# Altium project slave2020.PrjPcb
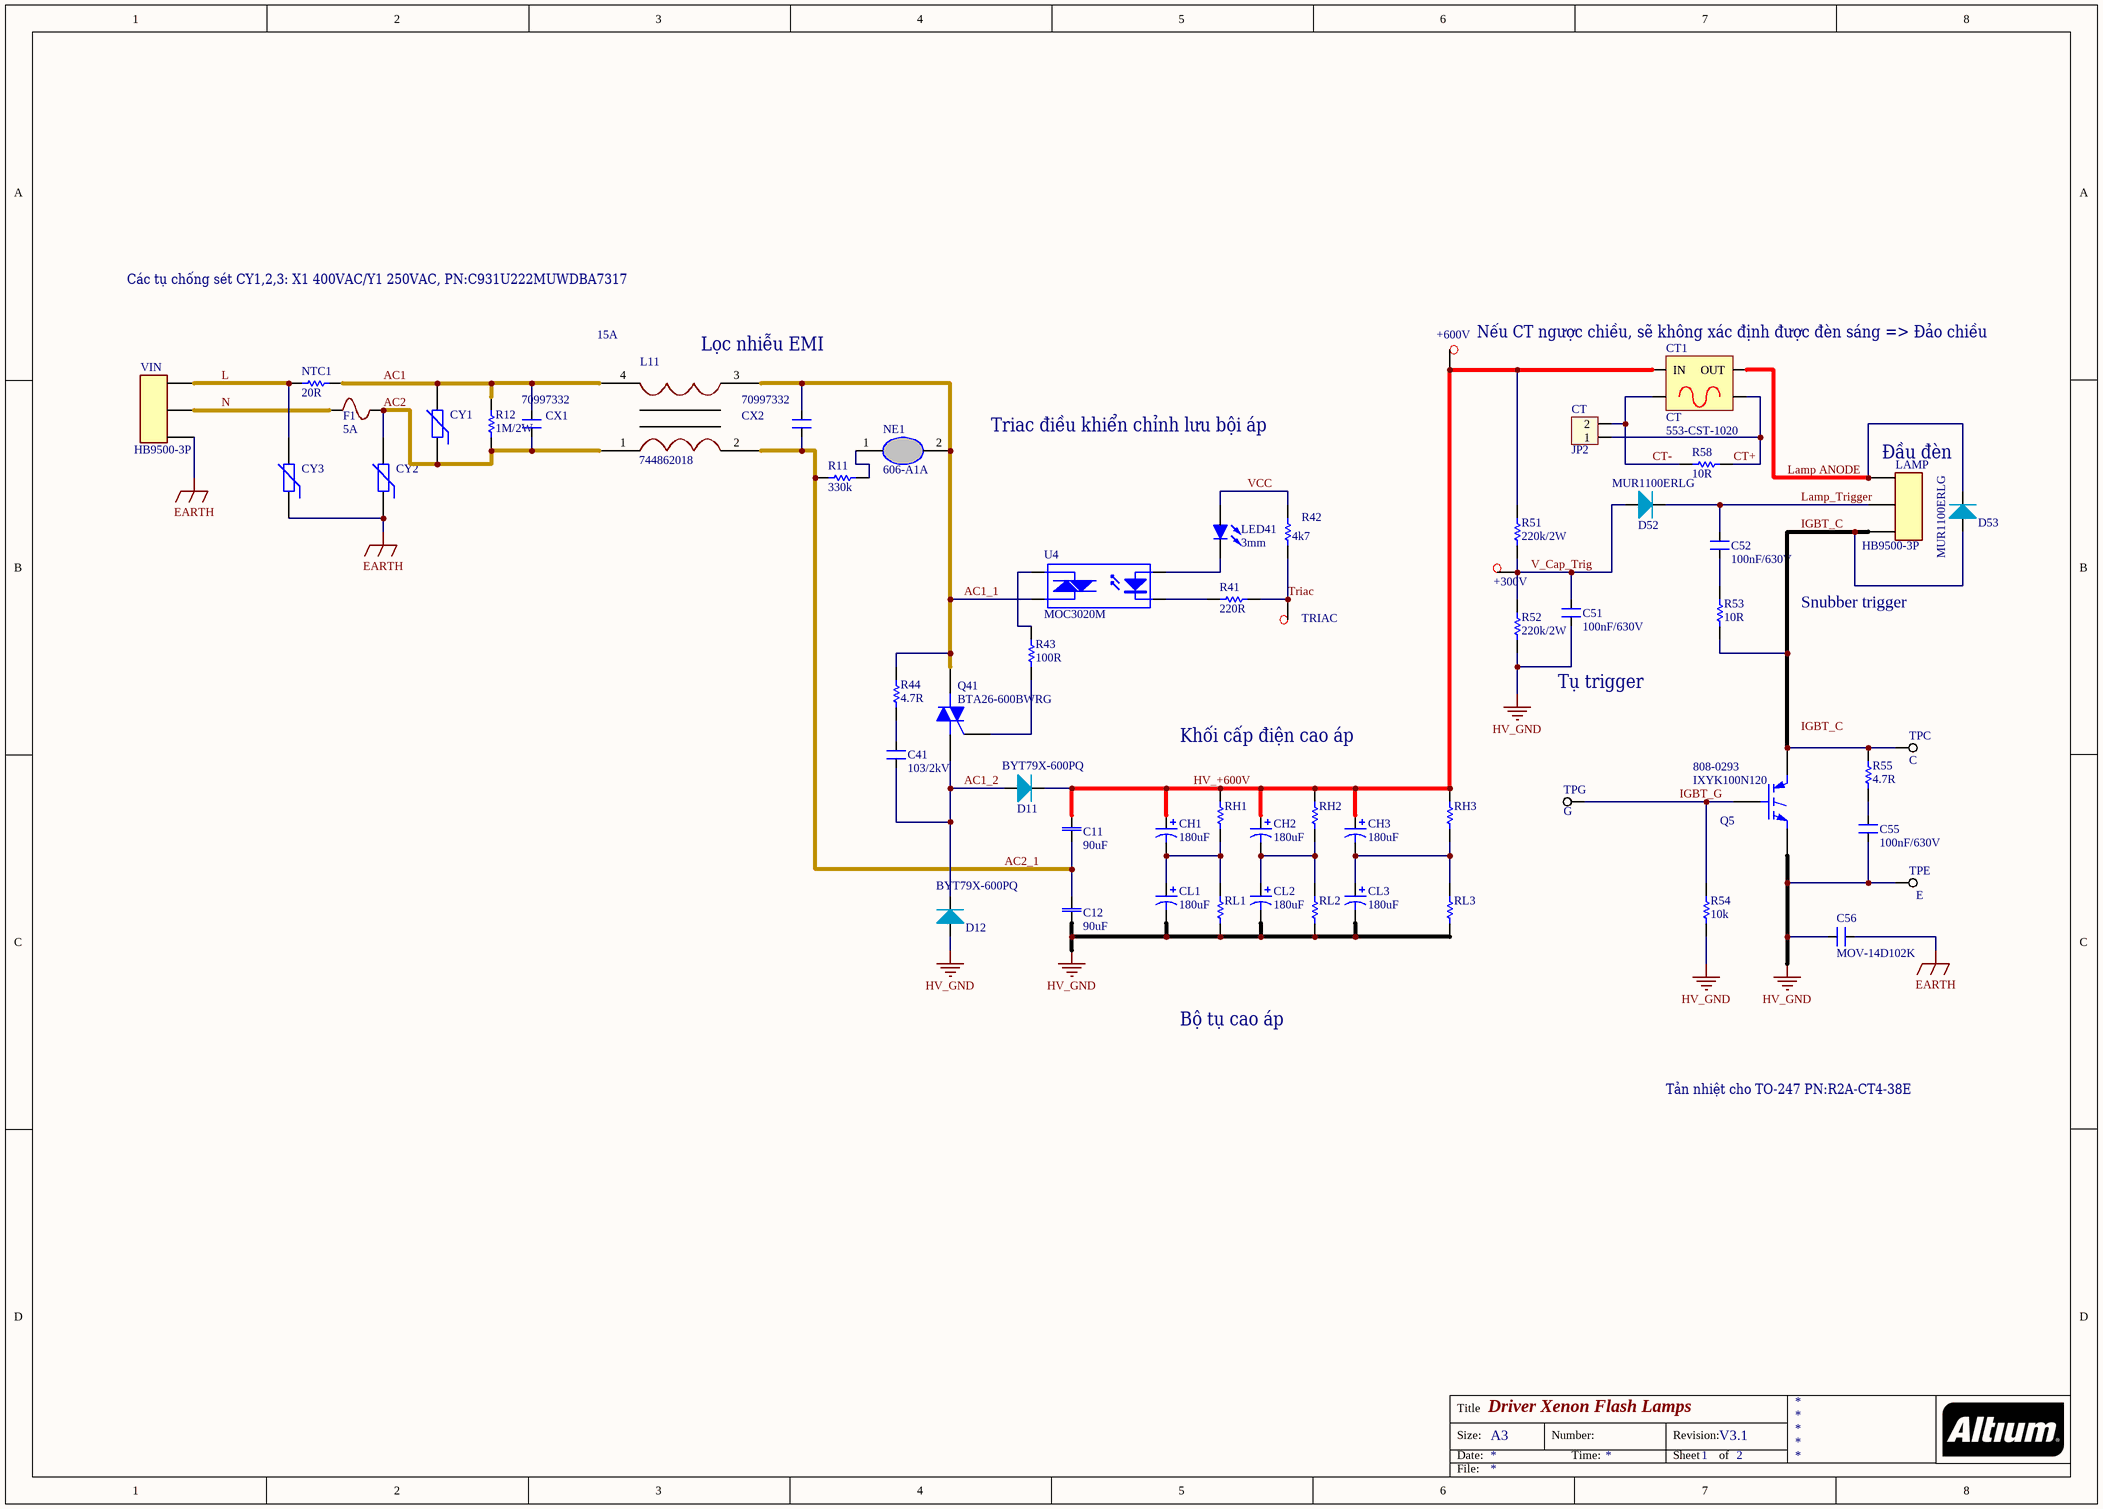
[diagram p0: IGBT2020.SchDoc]
2 sheets, 119 parts. Net scope: global (net labels, ports and power ports of the same name join across sheets).
Board file: slave2020.PcbDoc
Sheets:
  IGBT2020.SchDoc
  DriveIGBT2020.SchDoc

## Sheet IGBT2020.SchDoc: Driver Xenon Flash Lamps
size A3; Date: 5/12/2017; CheckedBy: Vũ Hoàng Phương; CompanyName: PE-LAB; DrawnBy: Bùi Trung Tuyến; Revision: V3.1; SheetNumber: 1; SheetTotal: 2; PageSetup: Record=PageOptions|CenterHorizontal=True|CenterVertical=True|PrintScale=0.71|XCorrection=1.00|YCorrection=1.00|PrintKind=1|BorderSize=5000000|LeftOffset=0|BottomOffset=0|Orientation=2|PaperLength=1000|PaperWidth=1000|Scale=100|PaperSource=257|PrintQuality=600|MediaType=1|DitherType=10|PrintScaleMode=1|PaperKind=A3|PaperIndex=8; Version: 3.1; ProjectName: ATTECH

### Parts
+300V  TP  [TP2]  (value not drawn)
+600V  TP  [TP2]  (value not drawn)
C11  Capacitance: 90uF  [Kemet 90uF 500V]  (hidden comment: C4AQ, Film, Metallized Polypropylene, Automotive DC Link, 90 uF, 10%, 500 V, 70C, Lead Spacing = 37.5mm)
C12  Capacitance: 90uF  [Kemet 90uF 500V]  (hidden comment: C4AQ, Film, Metallized Polypropylene, Automotive DC Link, 90 uF, 10%, 500 V, 70C, Lead Spacing = 37.5mm)
C41  103/2kV  [CN2-LT]
C51  100nF/630V  [X2 CAP]
C52  100nF/630V  [X2 CAP]
C55  100nF/630V  [X2 CAP]
C56  MOV-14D102K  [MOV]
CH1  180uF  [CAP 25x50]
CH2  180uF  [CAP 25x50]
CH3  180uF  [CAP 25x50]
CL1  180uF  [CAP 25x50]
CL2  180uF  [CAP 25x50]
CL3  180uF  [CAP 25x50]
CT  JP2  [CON2]
CT1  CT  Supplier Part Number 1: 553-CST-1020  [PCBComponent_1]
CX1  spn1: 70997332  [X2 CAP]  (hidden comment: Tụ lọc nhiễu X2 chân cắm220nF70997332)
CX2  spn1: 70997332  [X2 CAP]  (hidden comment: Tụ lọc nhiễu X2 chân cắm220nF70997332)
CY1  Varistor chân cắmC931U222MUWDBA7317  [MOV]  (value not drawn)
CY2  Varistor chân cắmC931U222MUWDBA7317  [MOV]  (value not drawn)
CY3  Varistor chân cắmC931U222MUWDBA7317  [MOV]  (value not drawn)
D11  Supplier Part Number 1: BYT79X-600PQ  [TO-220F]  (hidden comment: Đi ốt cắmBYT79X-600PQ)
D12  Supplier Part Number 1: BYT79X-600PQ  [TO-220F]  (hidden comment: Đi ốt cắmBYT79X-600PQ)
D52  vl1: MUR1100ERLG  [DO-41]  (hidden comment: Đi ốt cắmMUR1100ERLG)
D53  vl1: MUR1100ERLG  [DO-41]  (hidden comment: Đi ốt cắmMUR1100ERLG)
F1  value 5A  [Fuse]  (hidden comment: Cầu chì ống thủy tinh5A)
L11  744862018  Max Current Rating: 15A  [Choke 5A]
LAMP  value HB9500-3P  [HB9500-3P]  (hidden comment: Giắc nguồn 3 chân. 9.5mm :HB9500-3P)
LED41  3mm  [LED 3mm]
NE1  606-A1A  [NE2]
NTC1  20R  [TO-126]
Q5  IXYK100N120  Supplier Part Number 1: 808-0293  [TO247+LageHeatsink]
Q41  BTA26-600BWRG  [TOP3]
R11  330k  [RES-1/4W]
R12  1M/2W  [RES-3W]
R41  220R  [RES-SMD-1206]
R42  4k7  [RES-SMD-1206]
R43  100R  [RES-1W]
R44  4.7R  [R1/4WD]
R51  220k/2W  [RES-3W]
R52  220k/2W  [RES-3W]
R53  10R  [R1/4WD]
R54  value 10k  [RES-1/4W]  (hidden comment: Điện trở cắm 1/4W10k)
R55  4.7R  [R1/4WD]
R58  10R  [R1/4WD]
RH1  Trở cắm 1W330k/1W  [RES-1W]  (value not drawn)
RH2  Trở cắm 1W330k/1W  [RES-1W]  (value not drawn)
RH3  Trở cắm 1W330k/1W  [RES-1W]  (value not drawn)
RL1  Trở cắm 1W330k/1W  [RES-1W]  (value not drawn)
RL2  Trở cắm 1W330k/1W  [RES-1W]  (value not drawn)
RL3  Trở cắm 1W330k/1W  [RES-1W]  (value not drawn)
TPC  C  [TP]
TPE  E  [TP]
TPG  G  [TP]
TRIAC  TP  [TP2]  (value not drawn)
U4  MOC3020M  [DIP6/W0.3]
VIN  value HB9500-3P  [HB9500-3P]  (hidden comment: Giắc nguồn 3 chân. 9.5mm :HB9500-3P)

### Nets
EARTH: C56.1 CY2.1 CY3.1 VIN.3
HV_GND: C12.1 C51.1 C55.1 C56.2 CL1.2 CL2.2 CL3.2 D12.A Q5.3(E) R52.1 R54.1 RL1.1 RL2.1 RL3.1 TPE.1
VCC: LED41.1 R42.2
AC1: CX1.2 CY1.2 L11.4 NTC1.2 R12.2
AC1_1: CX2.2 L11.3 NE1.2 Q41.2(M2) R44.2 U4.4(Main_term)
AC1_2: C41.1 D11.A D12.K Q41.1(M1)
AC2: CX1.1 CY1.1 CY2.2 F1.2 L11.1 R12.1
AC2_1: C11.1 C12.2 CX2.1 L11.2 R11.1
CT+: CT.1 CT1.2(CT) R58.1
CT-: CT.2 CT1.1(CT) R58.2
HV_+600V: +600V.1 C11.2 CH1.1 CH2.1 CH3.1 CT1.4(IN) D11.K R51.2 RH1.2 RH2.2 RH3.2
IGBT_C: D53.A LAMP.3 Q5.2(C) R53.1 R55.2 TPC.1
IGBT_G: Q5.1(G) R54.2 TPG.1
L: CY3.2 NTC1.1 VIN.2
Lamp ANODE: CT1.3(OUT) D53.K LAMP.2
Lamp_Trigger: C52.2 D52.K LAMP.1
N: F1.1 VIN.1
Triac: R41.1 R42.1 TRIAC.1
V_Cap_Trig: +300V.1 C51.2 D52.A R51.1 R52.2
NetC41_2: C41.2 R44.1
NetC52_1: C52.1 R53.2
NetC55_2: C55.2 R55.1
NetCH1_2: CH1.2 CL1.1 RH1.1 RL1.2
NetCH2_2: CH2.2 CL2.1 RH2.1 RL2.2
NetCH3_2: CH3.2 CL3.1 RH3.1 RL3.2
NetLED41_2: LED41.2 U4.1(A)
NetNE1_1: NE1.1 R11.2
NetQ41_3: Q41.3(G) R43.1
NetR41_2: R41.2 U4.2(K)
NetR43_2: R43.2 U4.6(Main_tern)

### Notes on the sheet
- Các tụ chống sét CY1,2,3: X1 400VAC/Y1 250VAC, PN:C931U222MUWDBA7317
- (near L11) Lọc nhiễu EMI
- Nếu CT ngược chiều, sẽ không xác định được đèn sáng => Đảo chiều
- Triac điều khiển chỉnh lưu bội áp
- (near LAMP) Đầu đèn
- Snubber trigger
- Tụ trigger
- Khối cấp điện cao áp
- Bộ tụ cao áp
- Tản nhiệt cho TO-247 PN:R2A-CT4-38E
- Labels drawn without touching a wire or pin: IGBT_C
- Title
- Size:
- Date:
- A3
- Number:
- Time:
- Revision:
- Sheet
- of
- File:

### Library data of the parts
C11 C12 = CAP NP: Manufacturer: WIMA; Manufacturer Part Number: C4AQLBW5900A3OK; cm1: Tụ điện dán 0603; cm2: Tụ điện dán 0805; cm3: Tụ điện dán 1206; Value: 104; ESR (Equivalent Series Resistance): 2.3mR; Voltage Rating: 800V; Dielectric: PP; Supplier 1: Mouser; Supplier Part Number 1: 505-DCP4-100/800/10L; Stock 1: 0; Min Operating Temperature: -55°C; Max Operating Temperature: 105°C; Packaging: Bulk; Tolerance: 10%; Termination: Radial; Length: 57mm; Height: 65mm; Width: 45mm; Lead Pitch: 52.5mm; ComponentLink1URL: http://www.wima.com/EN/WIMA_DC_Link_MKP_4.pdf; ComponentLink1Description: http://www.wima.com/EN/WIMA_DC_Link_MKP_4.pdf
C41 = CN: Tụ cao áp chân cắm; cm1: Tụ lọc nhiễu X2 chân cắm; cm2: Tụ chống sét - Varistor chân cắm; cm3: Tụ kẹo chân cắm; cm4: Tụ dán SMD 1206; Value: 103/2kV; cm5: Tụ cao áp chân cắm
C51 C52 C55 = CN: 0.1µF Film Capacitor 250V 630V Polypropylene (PP), Metallized Radial 0.709" L x 0.276" W (18.00mm x 7.00mm); Manufacturer: TDK EPCOS; Manufacturer Part Number: B32652-A6104-J; cm1: Tụ lọc nhiễu X2 chân cắm; cm2: Tụ chống sét - Varistor chân cắm; cm3: Tụ kẹo chân cắm; cm4: Tụ dán SMD 1206; cm5: Tụ cao áp chân cắm; Capacitance: 100nF; Tolerance: 5%; Lead Diameter: 0.8mm; Lead Length: 6mm; Value: 100nF/630V; Supplier 1: Avnet; Supplier Part Number 1: B32652A6104J; Stock 1: 0; Pricing 1: 1=0.4069, 10=0.3499, 25=0.3489, 50=0.3489, 100=0.2639 (USD); Mount: Through Hole; Case/Package: Radial; Dielectric Material: PP; Contact Plating: Matte,Tin; Min Operating Temperature: -55°C; Max Operating Temperature: 100°C; Voltage Rating: 630V; Packaging: Bulk; Voltage Rating (DC): 630V; Dielectric: PP; Termination: PC Pins; Package Quantity: 1000; Voltage Rating (AC): 250V; Length: 0.709inch; Width: 0.276inch; Depth: 7mm; Lead Pitch: 15mm; Height - Seated (Max): 0.492inch; REACH SVHC: No SVHC; Lead Free: Lead Free; Flammability Rating: UL94 V-0
C56 = CN: Tụ cao áp chân cắm; Manufacturer: Bourns; cm1: Tụ lọc nhiễu X2 chân cắm; cm2: Tụ chống sét - Varistor chân cắm; cm3: Tụ kẹo chân cắm; cm4: Tụ dán SMD 1206; Voltage Rating (DC): 1kV; Voltage Rating (AC): 625V; Capacitance: 200pF; Current Rating: 50A; Tolerance: 10%; Max Surge Current: 4.5kA; Max Voltage Rating (DC): 825V; Number of Circuits: 1; Energy: 190J; Clamping Voltage: 1.65kV; Min Varistor Voltage: 900V; Max Varistor Voltage: 1.1kV; Value: MOV-14D102K; cm5: Tụ cao áp chân cắm; Supplier 1: Mouser; Supplier Part Number 1: 652-MOV-14D102K; Manufacturer Part Number: MOV-14D102K; Stock 1: 4534; Pricing 1: 1=0.69, 10=0.507, 50=0.507, 100=0.435, 1000=0.246, 10000=0.188 (USD); Mount: Radial,Through Hole; Case/Package: Metal; Weight: 0.105822oz; Min Operating Temperature: -40°C; Max Operating Temperature: 85°C; Package Quantity: 500; Packaging: Bulk; Max Voltage Rating (AC): 625V; Clamping Current: 50A; Varistor Voltage: 1kV; Diameter: 14mm; Lead Pitch: 7.5mm; Radiation Hardening: No; REACH SVHC: No SVHC
CH1-CH3 CL1-CL3 = CP: WURTH ELEKTRONIK         861141483005             Electrolytic Capacitor, Snap-in, 150 F, 450 V, WCAP-AI3H Series,  20%, 22 mm, 10 mm; Manufacturer: Wurth Electronics; Value: 400V/150uF; cm1: Tu nhôm 450V/150uF  cắm; cm3: Tu hóa < 22uF/16>50V cắm; cm2: Tụ hóa 1000uF/35V cắm; Voltage Rating: 450V; Polarity: Polar; Ripple Current: 880mA; Life (Hours): 3000Hour; Supplier 1: Mouser; Supplier Part Number 1: EKXJ401ELL181MM45S; Manufacturer Part Number: 861141483005; Stock 1: 96; Pricing 1: 1=6.18, 10=6.17, 50=5.36, 100=4.62, 1000=3.23, 10000=2.82 (USD); Mount: Through Hole; Case/Package: Radial; Min Operating Temperature: -25°C; Max Operating Temperature: 105°C; Package Quantity: 100; Packaging: Tray; Tolerance: 20%; Voltage Rating (DC): 450V; Capacitance: 180uF; Diameter: 22mm; Height: 46mm; Lead Pitch: 0.394inch; Height - Seated (Max): 1.89inch; REACH SVHC: Unknown
CT = Con2: Connector 2; Value: Connector 2
CT1 = CT: Biến dòng cách ly 20A/20mA; Manufacturer: Triad Magnetics; Input Current: 20A; Turns Ratio: 1000:1; DC Resistance (DCR): 40R; Frequency: 60Hz; Power Rating: 40mW; Approvals: UL; Supplier 1: Mouser; Manufacturer Part Number: CST-1020; Stock 1: 124; Pricing 1: 1=6.39, 10=5.2, 50=4.55, 100=4.48, 1000=4.06, 10000=4.06 (USD); Mount: PCB,Through Hole; Weight: 0.705479oz; Current Rating: 20A; Package Quantity: 1; Packaging: Bulk; Termination: PC Pin; Length: 23.5mm; Height: 24.8mm; Width: 12mm; Height - Seated (Max): 24.8mm; REACH SVHC: Unknown; Lead Free: Lead Free
CX1 CX2 = CN: Tụ lọc nhiễu X2 chân cắm; Manufacturer: Wurth Electronics; Manufacturer Part Number: 890324024002CS; Value: 0.1->0.47uF; cm2: Tụ chống sét - Varistor chân cắm; cm3: Tụ kẹo chân cắm; cm4: Tụ dán SMD 1206; cm5: Tụ cao áp chân cắm; Dielectric Material: PP; Capacitance: 220nF; Tolerance: 10%; Voltage Rating (AC): 275V; cm1: Tụ lọc nhiễu X2 chân cắm; Supplier 1: Allied Electronics; Stock 1: 100; Pricing 1: 1=0.52, 50=0.474, 100=0.436, 250=0.404, 500=0.376 (USD); Mount: Through Hole; Case/Package: Radial; Min Operating Temperature: -40°C; Max Operating Temperature: 105°C; Packaging: Bulk; Dielectric: PP; Termination: PC Pins; Length: 0.591inch; Width: 0.276inch; Height - Seated (Max): 0.512inch; Lead Pitch: 0.492inch; REACH SVHC: Unknown
CY1-CY3 = Varistor: Ceramic Disc Capacitors 250volts 2200pF 20% Y5U; Manufacturer: KEMET; Value: 270V; Dielectric Material: PP; Capacitance: 2.2nF; Voltage Rating (AC): 250V; Dissipation Factor: 2.5%; Lead/Base Style: Kinked; cm: Varistor chân cắm; Supplier 1: Mouser; Supplier Part Number 1: 80-C931U222MUWDBAP; mpn: C931U222MUWDBA7317; Stock 1: 5642; Pricing 1: 1=1.53, 10=1.18, 50=1.18, 100=0.747, 1000=0.509, 10000=0.509 (USD); Mount: Through Hole; Case/Package: Radial; Contact Plating: Tin; Min Operating Temperature: -25°C; Max Operating Temperature: 125°C; Package Quantity: 500; Tolerance: 20%; Packaging: Cut Tape; Voltage Rating: 250V; Dielectric: Y5U; Termination: Radial; Composition: Ceramic; Voltage: 250V; Diameter: 10mm; Lead Pitch: 10mm; Depth: 5mm; REACH SVHC: No SVHC
D11 D12 = Diode: Manufacturer: WeEn Semiconductors; cm2: Đi ốt dán; vl2: FR307; vl3: TVS 1.5KE300A 19A 300V; vl4: HER508 5A 1000V; cm1: Đi ốt cắm; Supplier 1: Avnet; MPN: BYT79X-600PQ; Stock 1: 0
D52 D53 = Diode: DIODE GEN PURP 1KV 1A AXIAL; Manufacturer: ON Semiconductor; cm2: Đi ốt dán; vl2: FR307; vl3: TVS 1.5KE300A 19A 300V; vl4: HER508 5A 1000V; Peak Reverse Current: 10uA; Max Surge Current: 35A; Reverse Recovery Time: 100ns; Element Configuration: Single; Forward Voltage: 1.75V; Polarity: Standard; cm1: Đi ốt cắm; Supplier 1: Mouser; Supplier Part Number 1: 863-MUR1100ERLG; Stock 1: 36652; Pricing 1: 1=0.41, 10=0.339, 50=0.339, 100=0.207, 1000=0.16, 10000=0.127 (USD); Case/Package: Axial; Number of Pins: 2; Weight: 100lb; Contact Plating: Matte,Tin; Min Operating Temperature: -65°C; Max Operating Temperature: 175°C; Packaging: Tape and Reel; Package Quantity: 1; Average Rectified Current: 1A; Max Reverse Voltage (DC): 1kV; Recovery Time: 100ns; Forward Current: 1A; Reverse Voltage: 1kV; Max Repetitive Reverse Voltage (Vrrm): 1kV; Max Forward Surge Current (Ifsm): 35A; Voltage Rating (DC): 1kV; Current Rating: 1A; Peak Non-Repetitive Surge Current: 35A; Output Current: 1A; Diameter: 2.7mm; Length: 5.2mm; Height: 2.7mm; Width: 2.7mm; Radiation Hardening: No; Lead Free: Lead Free; REACH SVHC: No SVHC; Halogen Free: Halogen Free
F1 = Fuse: Cầu chì ống thủy tinh; cm1: Cầu chì ống thủy tinh
L11 = Choke: Cuộn cảm lọc nguồn đầu vào; Manufacturer: Wurth Electronics; Core Material: Ferrite; Number of Lines: 2; Tolerance: 50%; Current Rating: 1A; Inductance: 1.8mh; DC Resistance (DCR): 310mR; Test Frequency: 10kHz; Voltage Rating (AC): 250V; Supplier 1: Mouser; Supplier Part Number 1: 710-744862018; Manufacturer Part Number: 744862018; Stock 1: 165; Pricing 1: 1=3.85, 10=3.6, 50=3.13, 100=2.82, 1000=2.29, 10000=1.91 (USD); Mount: Through Hole; Case/Package: SMD/SMT; Min Operating Temperature: -40°C; Max Operating Temperature: 125°C; Package Quantity: 30; Packaging: Rail/Tube; Max DC Current: 1A; Termination: Radial; Current: 1A; Resistance: 310mR; Length: 17mm; Height: 17mm; Width: 11mm; Depth: 11mm; Lead Pitch: 8mm; REACH SVHC: No SVHC; Supplier 2: RSComponents; Supplier Part Number 2: 899-6968; Stock 2: 0
LAMP VIN = HEADER 3: Pitch：9.5mm；Poles：3P；Rated Voltage/Current：300V/25A; cm1: Giắc nguồn 3 chân. 9.5mm :
  LAMP: Parameter: Pitch：9.5mm；Poles：3P；Rated Voltage/Current：300V/25A
  VIN: cm: *
LED41 = LED 3mm: Led vàng chân cắm; cm: Led đỏ; Value: 3mm
NE1 = NE: T2 WIRE TERMINAL NEON (NE-2); Manufacturer: VCC CHML; Manufacturer Part Number: A1A; Value: Đèn Neon; Lens Colour: Clear; Voltage Rating (AC): 250V; Current Rating: 600uA; Voltage Rating: 90V; Viewing Angle: 170°; Voltage: 1.8V; Life (Hours): 25000Hour; cm: *; Supplier 1: Mouser; Supplier Part Number 1: 606-A1A; Stock 1: 7888; Pricing 1: 1=0.28, 10=0.28, 50=0.26, 100=0.23, 1000=0.19, 10000=0.19 (USD); Mount: Surface Mount; Colour: Clear,Orange; Package Quantity: 200; Packaging: Bulk; Operating Supply Current: 600uA; Lead/Base Style: Wire Terminal
NTC1 = Resistor: NTC; Manufacturer: Bourns; Manufacturer Part Number: PWR221T-30-R100F; cm1: Trở dán SMD 1206; cm2: Trở cắm 1W; cm3: Trở cắm 2W; cm4: Trở cắm 5W; cm5: Trở cắm 1/4W; Tolerance: 1%; Resistance: 100mR; Power Rating: 30W; Voltage Rating: 2kV; Temperature Coefficient: 300ppm/°C; Threshold Voltage: 1.7V; Voltage Rating (DC): 250V; Lead Diameter: 0.72mm; Value: 20R; cm6: NTC; Supplier 1: Mouser; Supplier Part Number 1: 652-PWR221T-30-R100F; Stock 1: 654; Pricing 1: 1=2.79, 10=2.48, 50=2.16, 100=1.89, 1000=1.17, 10000=1.15 (USD); Mount: Through Hole; Case/Package: TO-220; Min Operating Temperature: -55°C; Max Operating Temperature: 150°C; Packaging: Rail/Tube; Package Quantity: 50; Composition: Thick Film; Number of Terminations: 2; Termination: Radial; Military Standard: Not; Max Power Dissipation: 30W; Features: Automotive AEC-Q200; Length: 10.41mm; Height: 16.26mm; Width: 0.125inch; Lead Pitch: 5.08mm; Terminal Pitch: 5.08mm; Depth: 3.18mm; REACH SVHC: No SVHC; ComponentLink1URL: https://www.bourns.com/docs/Product-Datasheets/PWR221T-30.pdf; ComponentLink1Description: https://www.bourns.com/docs/Product-Datasheets/PWR221T-30.pdf; ComponentLink2URL: http://www.bourns.com/data/global/pdfs/PWR221T-30.pdf; ComponentLink2Description: http://www.bourns.com/data/global/pdfs/PWR221T-30.pdf; ComponentLink3URL: http://www.mouser.com/ds/2/54/wr221t-30-777826.pdf; ComponentLink3Description: http://www.mouser.com/ds/2/54/wr221t-30-777826.pdf
Q5 = IGBT: IGBT 1200V 188A 1150W TO264; Manufacturer: IXYS; Manufacturer Part Number: IXYK100N120C3; cm: Uce = 1200V; Icp = 530A; Collector Emitter Voltage (VCEO): 1.2kV; Max Power Dissipation: 1.15kW; Collector Emitter Saturation Voltage: 2.9V; Turn-On Delay Time: 32ns; Turn-Off Delay Time: 123ns; Element Configuration: Single; Value: IXYK100N120; Supplier 1: RSComponents; Stock 1: 0; Pricing 1: 1=16.33, 5=15.17, 10=14.52, 30=13.94, 90=13.23 (EUR); Mount: Through Hole; Case/Package: TO-264-3; Number of Pins: 3; Min Operating Temperature: -55°C; Max Operating Temperature: 175°C; Package Quantity: 25; Packaging: Rail/Tube; Max Collector Current: 188A; Power Dissipation: 1.15kW; Collector Emitter Breakdown Voltage: 1.2kV; Length: 20.29mm; Height: 26.59mm; Width: 5.31mm; Lead Free: Lead Free
Q41 = BTA26-600: TRIAC, 25A, 600V, TOP-3; Manufacturer: STMicroelectronics; Hold Current: 75mA; Element Configuration: Single; Channel Type: Bidirectional; Isolation Voltage: 2.5kV; Value: BTA26-600; cm1: Triac; Supplier 1: Mouser; Supplier Part Number 1: 511-BTA26-600BW; Manufacturer Part Number: BTA26-600BWRG; Stock 1: 0; Pricing 1: 1=5.05, 10=4.29, 50=4.29, 100=3.72, 1000=2.67, 10000=2.54 (USD); Mount: Through Hole; Number of Pins: 3; Contact Plating: Matte,Tin; Min Operating Temperature: -40°C; Max Operating Temperature: 125°C; Packaging: Rail/Tube; Package Quantity: 30; Max Repetitive Reverse Voltage (Vrrm): 600V; RMS Current (Irms): 25A; Current Rating: 25A; Voltage Rating (DC): 600V; Length: 15.5mm; Height: 21.1mm; Width: 4.6mm; Radiation Hardening: No; Lead Free: Lead Free; REACH SVHC: No SVHC
R11 = Resistor: Trở cắm 1/4W; cm1: Trở dán SMD 1206; cm2: Trở cắm 1W; cm3: Trở cắm 2W; cm4: Trở cắm 5W; cm6: NTC; Value: 330k; cm5: Trở cắm 1/4W
R12 R44 R51-R53 R55 R58 = Resistor: Trở cắm 2W; cm1: Trở dán SMD 1206; cm2: Trở cắm 1W; cm4: Trở cắm 5W; cm5: Trở cắm 1/4W; cm6: NTC; cm3: Trở cắm 2W
  R12: Value: 1M/2W
  R44 R55: Value: 4.7R
  R51 R52: Value: 220k/2W
  R53 R58: Value: 10R
R41 R42 = Resistor: Trở dán SMD 1206; cm2: Trở cắm 1W; cm3: Trở cắm 2W; cm4: Trở cắm 5W; cm5: Trở cắm 1/4W; cm6: NTC; cm1: Trở dán SMD 1206
  R41: Value: 220R
  R42: Value: 4k7
R43 = Resistor: Trở cắm 1W; cm1: Trở dán SMD 1206; cm3: Trở cắm 2W; cm4: Trở cắm 5W; cm5: Trở cắm 1/4W; cm6: NTC; Value: 100R; cm2: Trở cắm 1W
R54 = Res: Resistor; cm1: Điện trở dán 0603; cm3: Điện trở dán 0805; cm4: Điện trở dán 1206; cm2: Điện trở cắm 1/4W
RH1-RH3 RL1-RL3 = Resistor: Trở cắm 2W; cm1: Trở dán SMD 1206; cm4: Trở cắm 5W; cm5: Trở cắm 1/4W; cm6: NTC; Value: 330k/1W; cm2: Trở cắm 1W; cm3: Trở cắm 2W
TPC = Test Point: Testpoint C; Value: C
TPE = Test Point: Testpoint E; Value: E
TPG = Test Point: Testpoint G; Value: G
U4 = MOC: OPTOISOLATOR 4.17KV TRIAC 6DIP; Manufacturer: ON Semiconductor / Fairchild; Manufacturer Part Number: MOC3020-M; cm: 400V Optoisolators Triac Driver Output; Value: MOC3020SM; Number of Channels: 1; Isolation Voltage: 5.3kV; Nominal Input Voltage: 1.15V; Max Input Voltage: 1.5V; Forward Current: 60mA; Reverse Breakdown Voltage: 3V; Power Dissipation: 330mW; Hold Current: 100uA; Approvals: UL; Supplier 1: Arrow Electronics, Inc.; Supplier Part Number 1: MOC3020M; Stock 1: 10; Pricing 1: 1=0.3556, 10=0.3226, 100=0.2522, 500=0.1997, 1000=0.1797 (USD); Mount: Through Hole; Case/Package: DIP; Number of Pins: 6; Weight: 0.855g; Contact Plating: Matte,Tin; Min Operating Temperature: -40°C; Max Operating Temperature: 85°C; Packaging: Bulk; Forward Voltage: 1.15V; Number of Elements: 1; Number of Circuits: 1; Package Quantity: 1000; Max Input Current: 60mA; Max Power Dissipation: 330mW; Input Current: 60mA; Length: 0.25inch; Height: 0.25inch; Width: 0.25inch; Radiation Hardening: No; Lead Free: Lead Free; REACH SVHC: No SVHC

## Sheet DriveIGBT2020.SchDoc: Driver Xenon Flash Lamps
size A4; Date: 5/12/2017; CheckedBy: Vũ Hoàng Phương; CompanyName: PE-LAB; DrawnBy: Bùi Trung Tuyến; DocumentNumber: 2; Revision: V3.1; SheetNumber: 2; SheetTotal: 2; VersionControl_RevNumber: V3.1; Version: 3.1; ProjectName: ATTECH
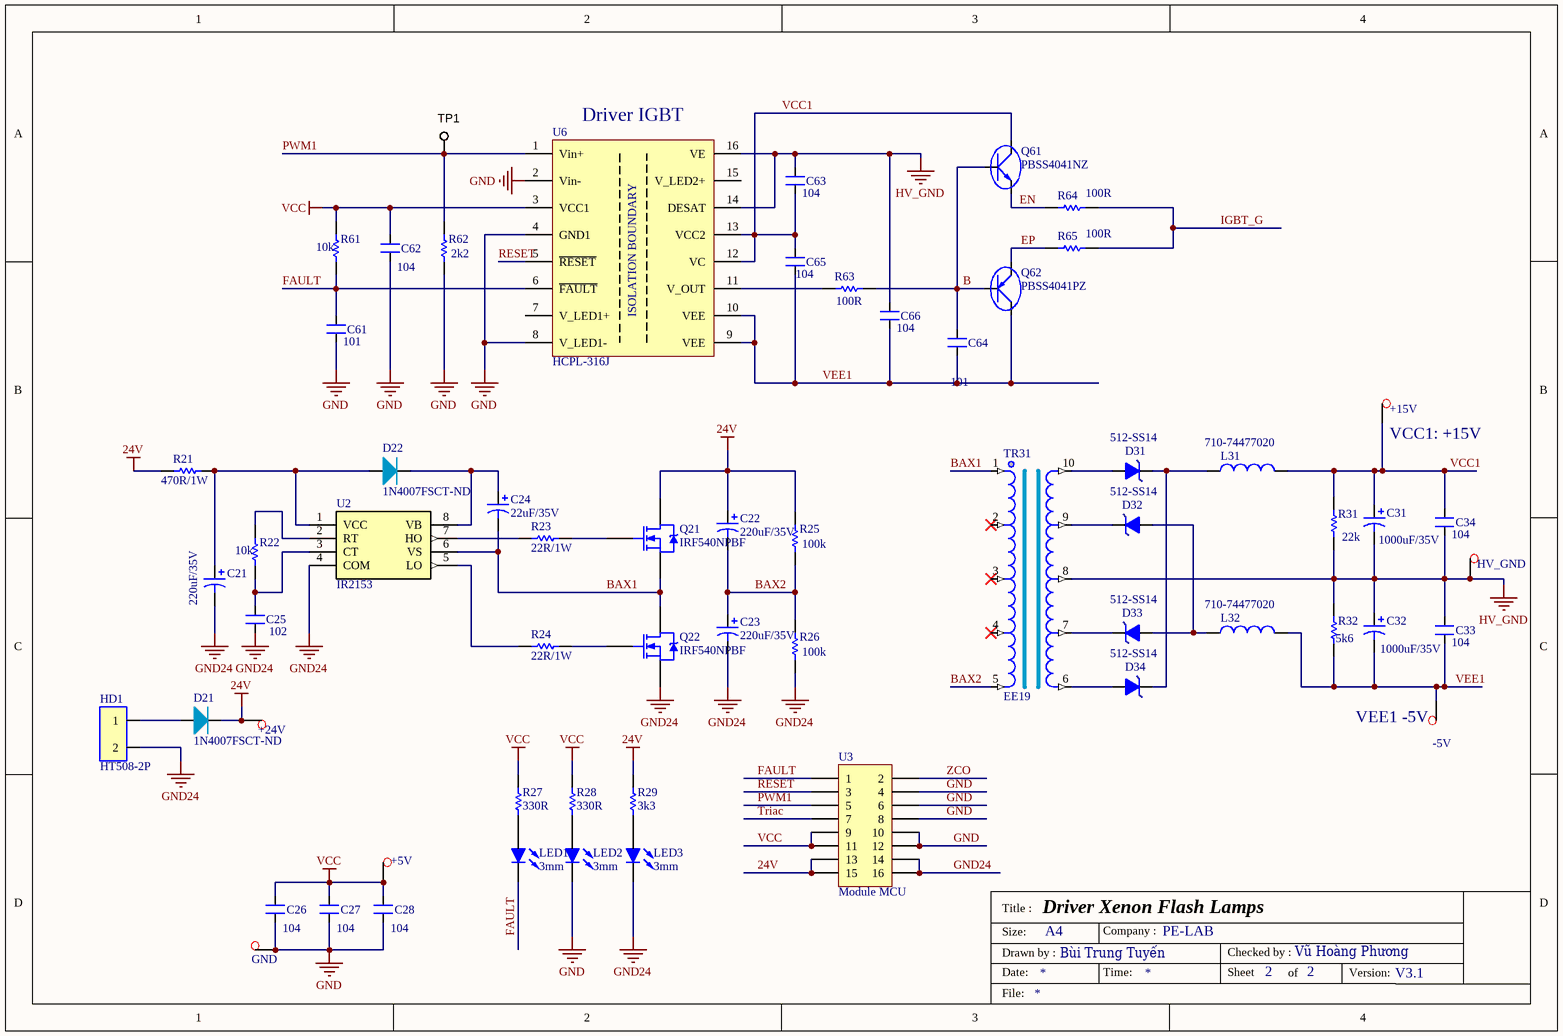
[diagram p1: DriveIGBT2020.SchDoc]

### Parts
+5V  TP  [TP2]  (value not drawn)
+15V  TP  [TP2]  (value not drawn)
+24V  TP  [TP2]  (value not drawn)
-5V  TP  [TP2]  (value not drawn)
C21  220uF/35V  [CP1.5/3.4]
C22  220uF/35V  [CP1.5/3.4]
C23  220uF/35V  [CP1.5/3.4]
C24  22uF/35V  [CP1.5/3.4]
C25  value 102  [CAPC3216N]  (hidden comment: Tụ dán SMD 1206102)
C26  value 104  [CAPC3216N]  (hidden comment: Tụ dán SMD 1206104)
C27  value 104  [CAPC3216N]  (hidden comment: Tụ dán SMD 1206104)
C28  value 104  [CAPC3216N]  (hidden comment: Tụ dán SMD 1206104)
C31  1000uF/35V  [CP1.5/3.4]
C32  1000uF/35V  [CP1.5/3.4]
C33  value 104  [CAPC3216N]  (hidden comment: Tụ dán SMD 1206104)
C34  value 104  [CAPC3216N]  (hidden comment: Tụ dán SMD 1206104)
C61  value 101  [CAPC3216N]  (hidden comment: Tụ dán SMD 1206101)
C62  value 104  [CAPC3216N]  (hidden comment: Tụ dán SMD 1206104)
C63  value 104  [CAPC3216N]  (hidden comment: Tụ dán SMD 1206104)
C64  value 101  [CAPC3216N]  (hidden comment: Tụ dán SMD 1206101)
C65  value 104  [CAPC3216N]  (hidden comment: Tụ dán SMD 1206104)
C66  value 104  [CAPC3216N]  (hidden comment: Tụ dán SMD 1206104)
D21  vl1: 1N4007FSCT-ND  [DO-41]  (hidden comment: Đi ốt cắm1N4007FSCT-ND)
D22  vl1: 1N4007FSCT-ND  [DO-41]  (hidden comment: Đi ốt cắm1N4007FSCT-ND)
D31  vl1: 512-SS14  [DO-214AC]  (hidden comment: Diode nhanh dán512-SS14)
D32  vl1: 512-SS14  [DO-214AC]  (hidden comment: Diode nhanh dán512-SS14)
D33  vl1: 512-SS14  [DO-214AC]  (hidden comment: Diode nhanh dán512-SS14)
D34  vl1: 512-SS14  [DO-214AC]  (hidden comment: Diode nhanh dán512-SS14)
GND  TP  [TP2]  (value not drawn)
HD1  HT508-2P  [HT508-2P]
HV_GND  TP  [TP2]  (value not drawn)
L31  Supplier Part Number 1: 710-74477020  [L-SMD-M-12x10]  (hidden comment: Cuộn cảm dán SMD100uH74477020)
L32  Supplier Part Number 1: 710-74477020  [L-SMD-M-12x10]  (hidden comment: Cuộn cảm dán SMD100uH74477020)
LED1  3mm  [LED 3mm]
LED2  3mm  [LED 3mm]
LED3  3mm  [LED 3mm]
Q21  IRF540NPBF  [TO-220-HEATSINK]
Q22  IRF540NPBF  [TO-220-HEATSINK]
Q61  PBSS4041NZ  [SOT223]
Q62  PBSS4041PZ  [SOT223]
R21  470R/1W  [RES-1W]
R22  value 10k  [RES-SMD-1206]  (hidden comment: Trở dán SMD 120610k)
R23  22R/1W  [RES-1W]
R24  22R/1W  [RES-1W]
R25  value 100k  [RES-SMD-1206]  (hidden comment: Trở dán SMD 1206100k)
R26  value 100k  [RES-SMD-1206]  (hidden comment: Trở dán SMD 1206100k)
R27  330R  [RES-SMD-1206]
R28  330R  [RES-SMD-1206]
R29  3k3  [RES-SMD-1206]
R31  value 22k  [RES-SMD-1206]  (hidden comment: Trở dán SMD 120622k)
R32  value 5k6  [RES-SMD-1206]  (hidden comment: Trở dán SMD 12065k6)
R61  value 10k  [RES-SMD-1206]  (hidden comment: Trở dán SMD 120610k)
R62  value 2k2  [RES-SMD-1206]  (hidden comment: Trở dán SMD 12062k2)
R63  value 100R  [RES-SMD-1206]  (hidden comment: Trở dán SMD 1206100R)
R64  value 100R  [RES-1W]  (hidden comment: Trở cắm 1W100R)
R65  value 100R  [RES-1W]  (hidden comment: Trở cắm 1W100R)
TP1  TESTPOINT_LEAD  [TP]  (value not drawn)  (no BOM)
TR31  EE19  [EE19]
U2  IR2153  [DIP8/W0.3]
U3  Module MCU  [MCU CONTROL]
U6  HCPL-316J  [SO16]

### Nets
24V: +24V.1 C22.1 D21.K Q21.2(D) R21.1 R25.2 R29.1 U3.13 U3.15
GND: C26.1 C27.1 C28.1 C61.1 C62.1 GND.1 LED2.2 R62.1 U3.4 U3.6 U3.8 U3.10 U3.12 U6.2(Vin-) U6.4(GND1) U6.8(V_LED1-)
GND24: C21.2 C23.2 C25.1 HD1.2 LED3.2 Q22.3(S) R26.1 U2.4(COM) U3.14 U3.16
HV_GND: C31.2 C32.1 C33.2 C34.1 C63.2 C66.2 HV_GND.1 R31.2 R32.1 TR31.8 U6.14(DESAT) U6.16(VE)
VCC: +5V.1 C26.2 C27.2 C28.2 C62.2 R27.1 R28.1 R61.2 U3.9 U3.11 U6.3(VCC1)
B: C64.2 Q61.1(B) Q62.1(B) R63.1
BAX1: C24.2 Q21.3(S) Q22.2(D) TR31.1 U2.6(VS)
BAX2: C22.2 C23.1 R25.1 R26.2 TR31.5
EN: Q61.3(E) R64.2
EP: Q62.3(E) R65.2
FAULT: C61.2 LED1.2 R61.1 U3.1 U6.6(~{FAULT})
IGBT_G: R64.1 R65.1
PWM1: R62.2 TP1.1 U3.5 U6.1(Vin+)
RESET: U3.3 U6.5(~{RESET})
Triac: U3.7
VCC1: +15V.1 C31.1 C34.2 C63.1 C65.2 L31.2 Q61.2(C) R31.1 U6.12(VC) U6.13(VCC2)
VEE1: -5V.1 C32.2 C33.1 C64.1 C65.1 C66.1 L32.2 Q62.2(C) R32.2 U6.9(VEE) U6.10(VEE)
ZCO: U3.2
NetC21_1: C21.1 D22.A R21.2 U2.1(VCC)
NetC24_1: C24.1 D22.K U2.8(VB)
NetC25_2: C25.2 R22.1 U2.3(CT)
NetD21_A: D21.A HD1.1
NetD31_1: D31.1(A) TR31.10
NetD31_2: D31.2(K) D34.2(K) L31.1
NetD32_1: D32.1(A) D33.1(A) L32.1
NetD32_2: D32.2(K) TR31.9
NetD33_2: D33.2(K) TR31.7
NetD34_1: D34.1(A) TR31.6
NetLED1_1: LED1.1 R27.2
NetLED2_1: LED2.1 R28.2
NetLED3_1: LED3.1 R29.2
NetQ21_1: Q21.1(G) R23.1
NetQ22_1: Q22.1(G) R24.1
NetR22_2: R22.2 U2.2(RT)
NetR23_2: R23.2 U2.7(HO)
NetR24_2: R24.2 U2.5(LO)
NetR63_2: R63.2 U6.11(V_OUT)

Not connected (* = marked no-connect by the designer): TR31 2* 3* 4*; U6 7(V_LED1+) 15(V_LED2+)

### Notes on the sheet
- (near U6) Driver IGBT
- (near +15V) VCC1: +15V
- (near -5V) VEE1 -5V
- Title :
- Size:
- Drawn by :
- Date:
- A4
- Time:
- Company :
- Sheet
- Checked by :
- of
- Version:
- File:
- (in symbol HCPL-316J) ISOLATION BOUNDARY

### Library data of the parts
C21-C23 = CP: Tụ hóa 220uF/35V cắm; cm1: Tu nhôm 450V/150uF  cắm; cm3: Tu hóa < 22uF/16>50V cắm; Value: 220uF/35V; cm2: Tụ hóa 220uF/35V cắm
C24 = CP: Tụ hóa 100uF/35V cắm; cm1: Tu nhôm 450V/150uF  cắm; cm3: Tu hóa < 22uF/16>50V cắm; cm2: Tụ hóa 22uF/35V cắm; Value: 22uF/35V
C25-C28 C33 C34 C61-C66 = CN: Tụ dán SMD 1206; cm1: Tụ lọc nhiễu X2 chân cắm; cm2: Tụ chống sét - Varistor chân cắm; cm3: Tụ kẹo chân cắm; cm5: Tụ cao áp chân cắm; cm4: Tụ dán SMD 1206
C31 C32 = CP: Tụ hóa 1000uF/35V cắm; cm1: Tu nhôm 450V/150uF  cắm; cm3: Tu hóa < 22uF/16>50V cắm; Value: 1000uF/35V; cm2: Tụ hóa 1000uF/35V cắm
D21 D22 = Diode: Manufacturer: ON Semiconductor / Fairchild; Manufacturer Part Number: 1N4007; cm2: Đi ốt dán; vl2: FR307; vl3: TVS 1.5KE300A 19A 300V; vl4: HER508 5A 1000V; Peak Non-Repetitive Surge Current: 30A; Peak Reverse Current: 5uA; Forward Voltage: 1.1V; Max Repetitive Reverse Voltage (Vrrm): 1kV; Element Configuration: Single; Forward Current: 1A; Polarity: Standard; Capacitance: 15pF; Power Dissipation: 3W; cm1: Đi ốt cắm; Supplier 1: Digi-Key; Stock 1: 0; Pricing 1: 1=0.18, 10=0.168, 100=0.0912, 500=0.05614, 1000=0.03827 (USD); Mount: Through Hole; Number of Pins: 2; Weight: 0.245g; Contact Plating: Matte,Tin; Min Operating Temperature: -65°C; Max Operating Temperature: 175°C; Packaging: Tape and Reel; Max Forward Surge Current (Ifsm): 30A; Max Surge Current: 30A; Package Quantity: 1000; Voltage Rating (DC): 1kV; Current Rating: 1A; Output Current: 1A; Average Rectified Current: 1A; Max Reverse Voltage (DC): 1kV; Reverse Voltage: 1kV; Diameter: 2.72mm; Length: 5.2mm; Height: 5.2mm; Width: 2.72mm; Radiation Hardening: No; REACH SVHC: No SVHC; Lead Free: Lead Free
D31-D34 = Diode: Diode nhanh dán; Manufacturer: ON Semiconductor / Fairchild; Value: SS14; cm1: Diode nhanh cắm; cm3: Diode zenner; Peak Reverse Current: 200uA; Forward Current: 1A; Max Repetitive Reverse Voltage (Vrrm): 40V; Element Configuration: Single; Forward Voltage: 500mV; Peak Non-Repetitive Surge Current: 40A; Polarity: Standard; Number of Elements: 1; Max Power Dissipation: 1.1W; cm2: Diode nhanh dán; Supplier 1: Mouser; Manufacturer Part Number: SS14; Stock 1: 456962; Pricing 1: 1=0.42, 10=0.294, 50=0.294, 100=0.135, 1000=0.104, 10000=0.081 (USD); Mount: Surface Mount; Case/Package: SMA; Number of Pins: 2; Weight: 0.003739oz; Number of Terminals: 2; Min Operating Temperature: -65°C; Max Operating Temperature: 125°C; Packaging: Tape and Reel; Package Quantity: 7500; Current Rating: 1A; Voltage Rating (DC): 40V; Max Forward Surge Current (Ifsm): 40A; Termination: SMD/SMT; Output Current: 1A; Average Rectified Current: 1A; Current: 1A; Voltage: 40V; Max Reverse Voltage (DC): 40V; Power Dissipation: 1.1W; Length: 4.75mm; Height: 2.2mm; Width: 2.95mm; Radiation Hardening: No; Lead Free: Lead Free; REACH SVHC: No SVHC
HD1 = HEADER2: 300V 10A; Value: HT508-2P; cm: 300V 10A
L31 L32 = Inductor: Cuộn cảm dán SMD; Manufacturer: Wurth Electronics; Value: 100uH; Core Material: Ferrite; Tolerance: 20%; Self Resonant Frequency: 5.2MHz; Shielding: Shielded; Max DC Current: 2.2A; DC Resistance (DCR): 220mR; Saturation Current: 2.4A; Test Frequency: 1kHz; cm2: Cuộn cảm dán SMD; Supplier 1: Mouser; pn: 74477020; Stock 1: 2215; Pricing 1: 1=2.25, 10=2.1, 50=1.95, 100=1.78, 1000=1.25, 10000=1.25 (USD); Mount: Surface Mount; Case/Package: Nonstandard; Number of Pins: 2; Weight: 0.04lb; Min Operating Temperature: -40°C; Max Operating Temperature: 125°C; Package Quantity: 500; Packaging: Tape and Reel; Inductance Tolerance: 20%; Inductance: 100uh; RMS Current (Irms): 2.2A; Termination: SMD/SMT; Current Rating: 2.2A; Series Resistance: 220mR; Composition: Wirewound; Resistance: 220mR; Length: 12mm; Height: 8mm; Width: 12mm; Depth: 12mm; Height - Seated (Max): 0.315inch; Lead Pitch: 7mm; REACH SVHC: Unknown
LED1 = LED 3mm: Led đỏ chân cắm; cm: Led đỏ; Value: 3mm
LED2 LED3 = LED 3mm: Led xanh chân cắm; cm: Led đỏ; Value: 3mm
Q21 Q22 = IRF540N: HEXFET Power MOSFET; Manufacturer: International Rectifier; Continuous Drain Current (ID): 33A; Gate to Source Voltage (Vgs): 20V; Power Dissipation: 130W; Rise Time: 35ns; Number of Elements: 1; Drain to Source Voltage (Vdss): 100V; Drain to Source Resistance: 44mR; Current Rating: 27A; Input Capacitance: 1.96nF; Turn-Off Delay Time: 39ns; Element Configuration: Single; Turn-On Delay Time: 11ns; Nominal Vgs: 4V; Recovery Time: 170ns; cm: HEXFET Power MOSFET; Value: IRF540N; Supplier 1: Arrow; Supplier Part Number 1: IRF540NPBF; Manufacturer Part Number: IRF540NPBF; Stock 1: 450; Pricing 1: 1=0.6745, 10=0.6227, 100=0.5214, 500=0.4542, 1000=0.4012 (USD); Mount: Through Hole; Case/Package: TO-220AB; Number of Pins: 3; Min Operating Temperature: -55°C; Max Operating Temperature: 175°C; Packaging: Rail/Tube; Drain to Source Breakdown Voltage: 100V; Voltage Rating (DC): 100V; Max Power Dissipation: 130W; Package Quantity: 50; Rds On Max: 44mR; Fall Time: 35ns; On-State Resistance: 44MR; Dual Supply Voltage: 100V; Termination: Through Hole; Threshold Voltage: 4V; Length: 10.54mm; Height: 8.77mm; Width: 4.69mm; Lead Pitch: 2.54mm; Radiation Hardening: No; Lead Free: Lead Free; REACH SVHC: No SVHC
Q61 = PBSS4041NZ: TRANS NPN 60V 7A SOT223; Manufacturer: NXP Semiconductors; Manufacturer Part Number: PBSS4041NZ,115; Max Power Dissipation: 2.6W; Transition Frequency: 105MHz; Emitter Base Voltage (VEBO): 5V; Element Configuration: Single; hFE Min: 300; Number of Elements: 1; Value: PBSS4041NZ; Supplier 1: Mouser; Supplier Part Number 1: 771-PBSS4041NZ115; Stock 1: 0; Pricing 1: 1=0.83, 10=0.682, 50=0.682, 100=0.44, 1000=0.352, 10000=0.287 (USD); Mount: Surface Mount; Case/Package: SC; Number of Pins: 4; Min Operating Temperature: -55°C; Max Operating Temperature: 150°C; Collector Emitter Voltage (VCEO): 60V; Max Collector Current: 7A; Polarity: NPN; Collector Emitter Breakdown Voltage: 60V; Collector Base Voltage (VCBO): 60V; Packaging: Tape and Reel; Package Quantity: 1; Max Breakdown Voltage: 60V; Power Dissipation: 2.6W; Gain Bandwidth Product: 105MHz; Radiation Hardening: No; Lead Free: Lead Free
Q62 = PBSS4041PZ: TRANS PNP 60V 5.7A SOT223; Manufacturer: NXP Semiconductors; Manufacturer Part Number: PBSS4041PZ,115; Max Power Dissipation: 2.6W; Transition Frequency: 110MHz; Emitter Base Voltage (VEBO): -5V; Element Configuration: Single; hFE Min: 200; Number of Elements: 1; Value: PBSS4041PZ; Supplier 1: Mouser; Supplier Part Number 1: 771-PBSS4041PZ115; Stock 1: 274; Pricing 1: 1=0.75, 10=0.62, 50=0.62, 100=0.4, 1000=0.32, 10000=0.261 (USD); Mount: Surface Mount; Case/Package: SC; Number of Pins: 4; Min Operating Temperature: -55°C; Max Operating Temperature: 150°C; Collector Emitter Voltage (VCEO): 60V; Max Collector Current: 5.7A; Packaging: Tape and Reel; Collector Emitter Breakdown Voltage: 60V; Polarity: PNP; Collector Base Voltage (VCBO): 60V; Package Quantity: 1; Max Breakdown Voltage: 60V; Power Dissipation: 2.6W; Frequency: 110MHz; Gain Bandwidth Product: 110MHz; Radiation Hardening: No
R21 R23 R24 R64 R65 = Resistor: as R43 on sheet IGBT2020; cm2: Trở cắm 1W
  R21: Value: 470R/1W
  R23 R24: Value: 22R/1W
R22 R25-R29 R31 R32 R61-R63 = Resistor: as R41 on sheet IGBT2020; cm1: Trở dán SMD 1206
  R27 R28: Value: 330R
  R29: Value: 3k3
TP1 = TESTPOINT_LEAD: TEST POINT
TR31 = Tranformer: Value: EE19
U2 = IR2153: IC, MOSFET/IGBT DRIVER HALF BRIDGE; Manufacturer: International Rectifier; Manufacturer Part Number: IR2153PBF; cm: Self-Oscillating Half-Bridge Driver; Frequency: 106kHz; Min Supply Voltage: 10V; Max Supply Voltage: 16.8V; Rise Time: 150ns; Number of Outputs: 2; Fall Time: 100ns; Power Dissipation: 1W; Nominal Supply Current: 5mA; Output Voltage: 20V; Max Output Current: 400mA; Value: IR2153; Supplier 1: Mouser; Supplier Part Number 1: 942-IR2153PBF; Stock 1: 8993; Pricing 1: 1=2.08, 10=1.76, 50=1.76, 100=1.41, 1000=1.03, 10000=0.88 (USD); Mount: Surface Mount,Through Hole; Case/Package: SOIC; Number of Pins: 8; Min Operating Temperature: -40°C; Max Operating Temperature: 125°C; Packaging: Rail/Tube; Package Quantity: 50; Number of Drivers: 2; Max Power Dissipation: 1W; Max Supply Current: 5mA; Max Frequency: 106kHz; Output Current: 400mA; Type: Integrated Circuit (IC); Turn-Off Delay Time: 100ns; Turn-On Delay Time: 150ns; Length: 10.92mm; Height: 4.94mm; Width: 7.11mm; Radiation Hardening: No; REACH SVHC: No SVHC; Lead Free: Lead Free
U6 = HCPL-316J: BROADCOM LIMITED         HCPL-316J-500E             OPTOCOUPLER, GATE DRIVE, 1-CH, 3.75KV; cm1: OPTOISO 5KV 2CH GATE DRIVER 16SO; Number of Channels: 2; Propagation Delay: 500ns; Isolation Voltage: 5kV; Max Output Current: 2.5A; Pulse Width Distortion (PWD): 300ns; High Level Output Current: 2A; Approvals: CSA,EN,IEC,UR; Value: HCPL-316J; Supplier 1: Digi-Key; Supplier Part Number 1: 516-1777-1-ND; Manufacturer: Broadcom; Manufacturer Part Number: HCPL-316J-500E; Stock 1: 5204; Pricing 1: 1=7.39, 10=6.161, 25=5.1748, 100=4.4356, 250=3.94272 (USD); Mount: Surface Mount; Case/Package: SOIC; Number of Pins: 16; Min Operating Temperature: -40°C; Max Operating Temperature: 100°C; Packaging: Tape and Reel; Low Level Output Current: 2A; REACH SVHC: No SVHC
U3 = Module MCU: Value: Module MCU

## Nets that join several sheets
HV_GND: IGBT2020 (15 pins), DriveIGBT2020 (12 pins)
VCC: IGBT2020 (LED41.1 R42.2), DriveIGBT2020 (11 pins)
IGBT_G: IGBT2020 (Q5.1 R54.2 TPG.1), DriveIGBT2020 (R64.1 R65.1)
Triac: IGBT2020 (R41.1 R42.1 TRIAC.1), DriveIGBT2020 (U3.7)